# EAGLE schematic brobot_pro_mini (EAGLE 7.2.0)
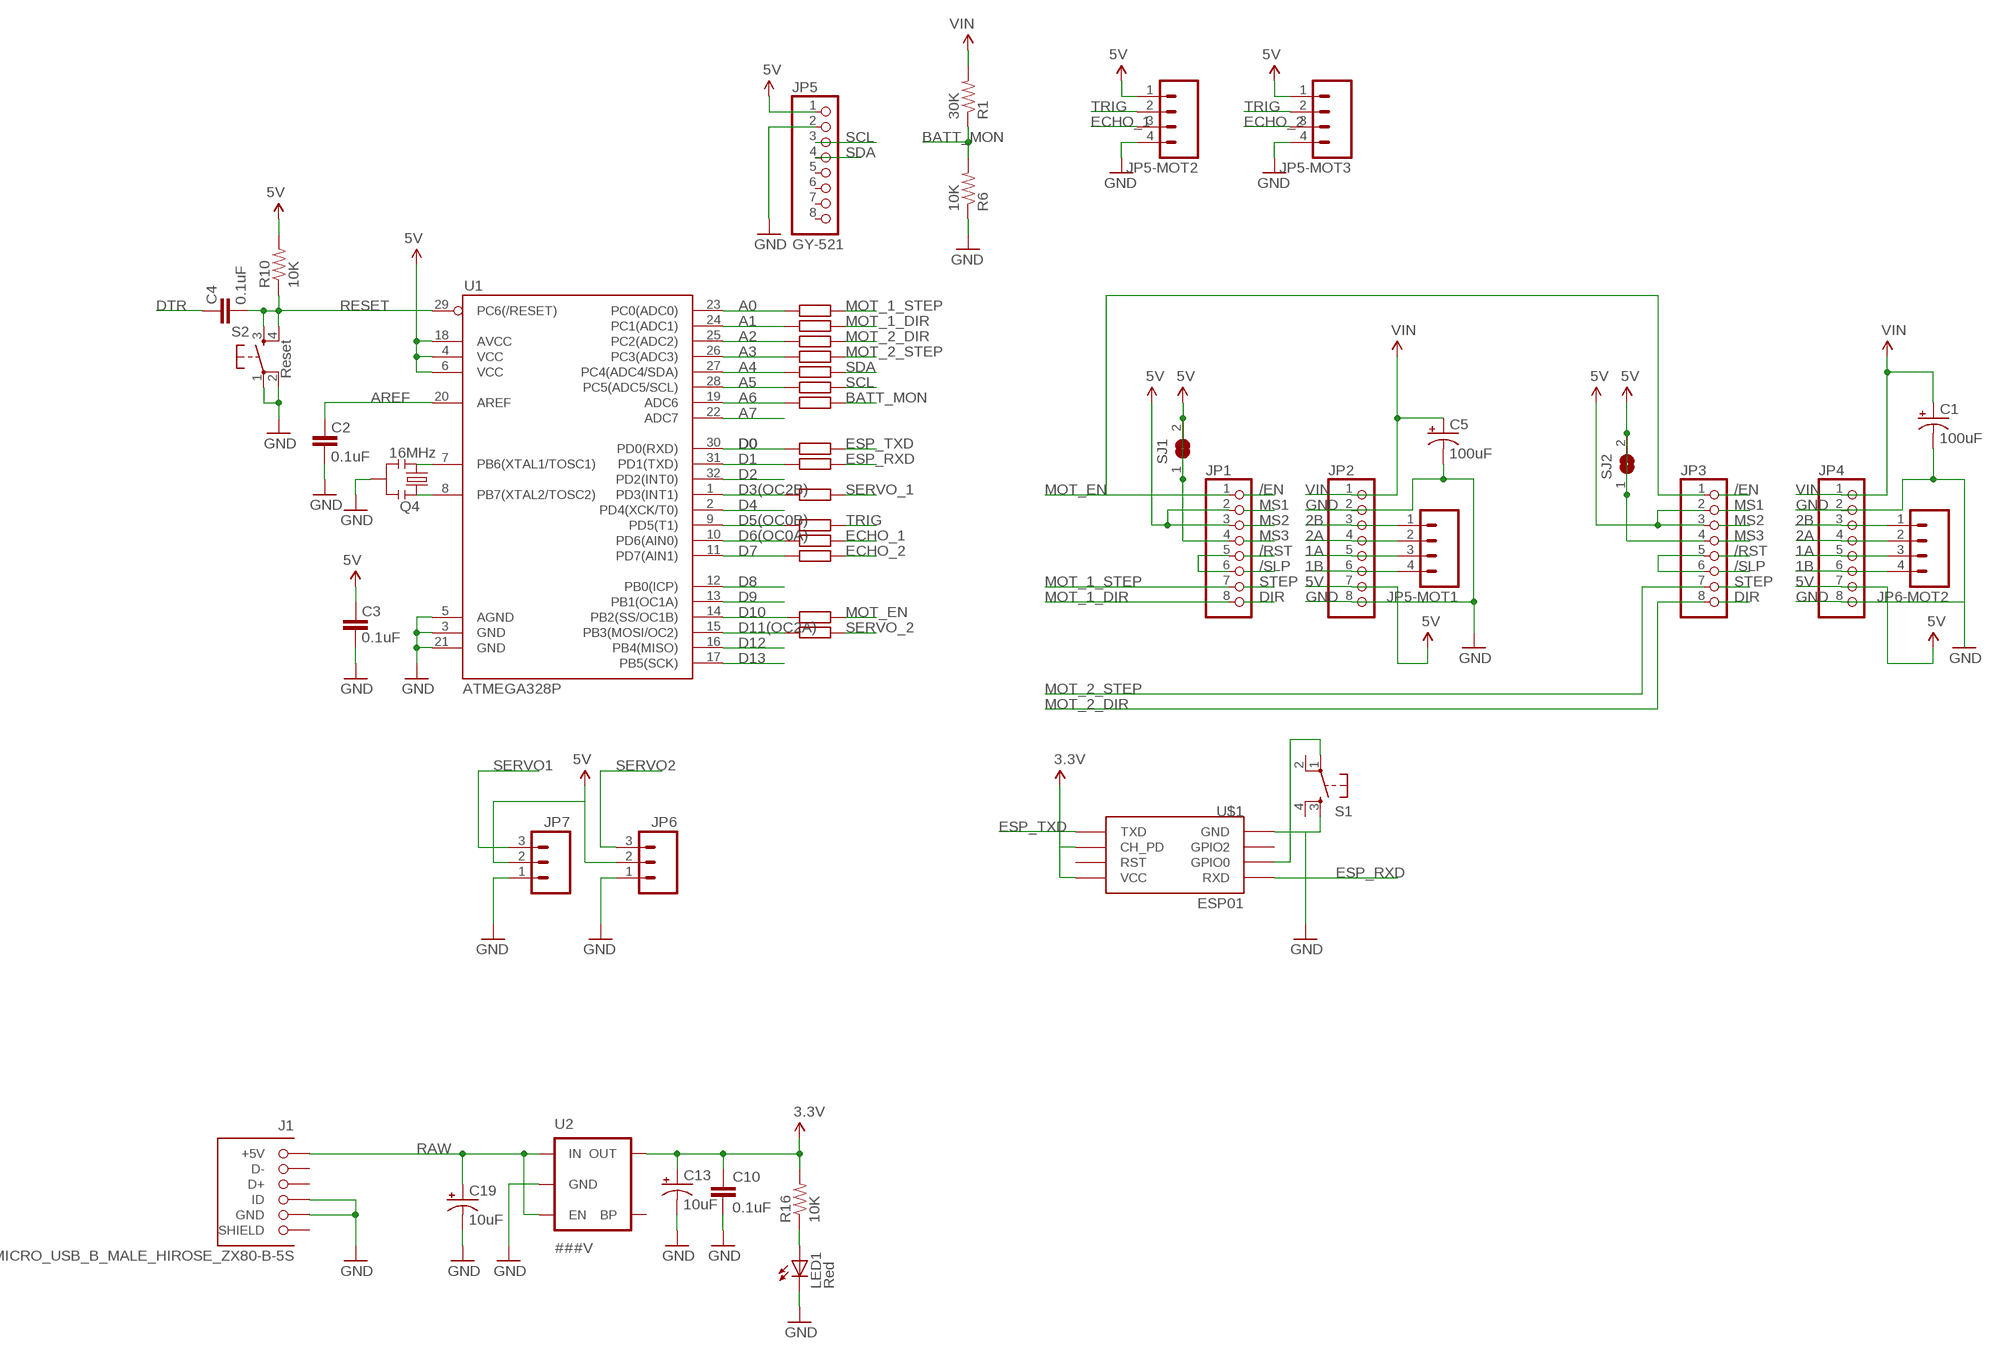
[diagram p0: schematic, sheet 1]

## Parts
C1  100uF  CAP_POLD  [PANASONIC_D]
C2  0.1uF  CAP0402  [C0402]
C3  0.1uF  CAP0402  [C0402]
C4  0.1uF  CAP0402  [C0402]
C5  100uF  CAP_POLD  [PANASONIC_D]
C10  0.1uF  CAP0402  [C0402]
C13  10uF  CAP_POL1206  [EIA3216]
C19  10uF  CAP_POL1206  [EIA3216]
J1  MICRO_USB_B_MALE_HIROSE_ZX80-B-5S  [USB_MICRO_B_MALE-HIROSE-ZX80-B-5S]
JP1  PINHD-1X8  [1X08]
JP2  PINHD-1X8  [1X08]
JP3  PINHD-1X8  [1X08]
JP4  PINHD-1X8  [1X08]
JP5  GY-521  PINHD-1X8  [1X08]
JP5-MOT1  M04PTH  [1X04]
JP5-MOT2  M04PTH  [1X04]
JP5-MOT3  M04PTH  [1X04]
JP6  M03PTH  [1X03]
JP6-MOT2  M04PTH  [1X04]
JP7  M03PTH  [1X03]
LED1  Red  LED0603  [LED-0603]
Q4  16MHz  RESONATORSMD  [RESONATOR-SMD]
R1  30K  RESISTOR0805-RES  [0805]
R6  10K  RESISTOR0805-RES  [0805]
R10  10K  RESISTOR0402  [C0402]
R16  10K  RESISTOR0402  [C0402]
S1  Reset  TAC_SWITCHSND  [TACTILE_SWITCH_SMD]
S2  Reset  TAC_SWITCHSND  [TACTILE_SWITCH_SMD]
SJ1  SJW  [SJW]
SJ2  SJW  [SJW]
U1  ATMEGA328P  ATMEGA168  [TQFP32-08]
U2  ###V  V_REG_LDOSMD  [SOT23-5]
U$1  ESP01  [ESP01]

## Nets
1A: JP2.5 JP4.5 JP5-MOT1.3 JP6-MOT2.3
1B: JP2.6 JP4.6 JP5-MOT1.4 JP6-MOT2.4
2A: JP2.4 JP4.4 JP5-MOT1.2 JP6-MOT2.2
2B: JP2.3 JP4.3 JP5-MOT1.1 JP6-MOT2.1
3.3V: U$1.CH_PD U$1.VCC
5V: C3.2 JP1.2 JP1.3 JP1.4 JP2.7 JP3.2 JP3.3 JP3.4 JP4.7 JP5-MOT2.1 JP5-MOT3.1 JP5.1 JP6.2 JP7.2 R10.2 SJ1.1 SJ1.2 SJ2.1 SJ2.2 U1.4(VCC) U1.6(VCC) U1.18(AVCC)
A0: U1.23(PC0(ADC0))
A1: U1.24(PC1(ADC1))
A2: U1.25(PC2(ADC2))
A3: U1.26(PC3(ADC3))
A4: U1.27(PC4(ADC4/SDA))
A5: U1.28(PC5(ADC5/SCL))
A6: U1.19(ADC6)
A7: U1.22(ADC7)
AREF: C2.2 U1.20(AREF)
BATT_MON: R1.1 R6.2
D0: U1.30(PD0(RXD))
D1: U1.31(PD1(TXD))
D2: U1.32(PD2(INT0))
D3(OC2B): U1.1(PD3(INT1))
D4: U1.2(PD4(XCK/T0))
D5(OC0B): U1.9(PD5(T1))
D6(OC0A): U1.10(PD6(AIN0))
D7: U1.11(PD7(AIN1))
D8: U1.12(PB0(ICP))
D9: U1.13(PB1(OC1A))
D10: U1.14(PB2(SS/OC1B))
D11(OC2A): U1.15(PB3(MOSI/OC2))
D12: U1.16(PB4(MISO))
D13: U1.17(PB5(SCK))
DTR: C4.2
ECHO_1: JP5-MOT2.3
ECHO_2: JP5-MOT3.3
ESP_RXD: U$1.RX(RXD)
ESP_TXD: U$1.TX(TXD)
GND: C1.- C2.1 C3.1 C5.- C10.2 C13.C(-) C19.C(-) J1.4(ID) J1.5(GND) JP2.2 JP2.8 JP4.2 JP4.8 JP5-MOT2.4 JP5-MOT3.4 JP5.2 JP6.1 JP7.1 LED1.C Q4.2 R6.1 S1.3 S2.1 S2.2 U1.3(GND) U1.5(AGND) U1.21(GND) U2.2(GND) U$1.GND
MOT_1_DIR: JP1.8
MOT_1_STEP: JP1.7
MOT_2_DIR: JP3.8
MOT_2_STEP: JP3.7
MOT_EN: JP1.1 JP3.1
N$1: JP1.5 JP1.6
N$2: JP3.5 JP3.6
N$4: S1.1 U$1.GPIO0
N$11: Q4.1 U1.8(PB7(XTAL2/TOSC2))
N$12: Q4.3 U1.7(PB6(XTAL1/TOSC1))
N$38: LED1.A R16.1
RAW [vcc]: C19.A(+) J1.1(+5V) U2.1(IN) U2.3(EN)
RESET: C4.1 R10.1 S2.3 S2.4 U1.29(PC6(/RESET))
SCL: JP5.3
SDA: JP5.4
SERVO1: JP7.3
SERVO2: JP6.3
TRIG: JP5-MOT2.2 JP5-MOT3.2
VCC: C10.1 C13.A(+) R16.2 U2.5(OUT) ; supply symbol labelled 3.3V
VIN: C1.+ C5.+ JP2.1 JP4.1 R1.2
Unconnected: J1.2(D-) J1.3(D+) J1.SHIELD1(SHIELD) J1.SHIELD2(SHIELD) J1.SHIELD3(SHIELD) J1.SHIELD4(SHIELD) JP5.5 JP5.6 JP5.7 JP5.8 S1.2 S1.4 U2.4(BP) U$1.GPIO2 U$1.RST

## Library data of the parts
C1 C5 = SparkFun-Passives:CAP_POL: Capacitor Polarized These are standard SMD and PTH capacitors. Normally 10uF, 47uF, and 100uF in electrolytic and tantalum varieties. Always verify the external diameter of the through hole cap, it varies with capacity, voltage, and manufacturer. The EIA devices should be standard.
C2-C4 C10 = SparkFun:CAP: Capacitor Standard 0603 ceramic capacitor, and 0.1" leaded capacitor.
C13 C19 = SparkFun:CAP_POL: Capacitor Polarized These are standard SMD and PTH capacitors. Normally 10uF, 47uF, and 100uF in electrolytic and tantalum varieties. Always verify the external diameter of the through hole cap, it varies with capacity, voltage, and manufacturer. The EIA devices should be standard.
J1 = connector:MICRO_USB_B_MALE_HIROSE_ZX80-B-5S: CONN PLUG MCR USB B PCB VERT; DIGIKEY: H11612-ND
JP1-JP5 = pinhead:PINHD-1X8: PIN HEADER
JP5-MOT1-JP5-MOT3 JP6-MOT2 = SparkFun-Connectors:M04: Header 4 Standard 4-pin 0.1" header. Use with straight break away headers (SKU : PRT-00116), right angle break away headers (PRT-00553), swiss pins (PRT-00743), machine pins (PRT-00117), and female headers (PRT-00115). Molex polarized connector foot print use with SKU : PRT-08231 with associated crimp pins and housings. 1MM SMD Version SKU: PRT-10208
JP6 JP7 = SparkFun-Connectors:M03: Header 3 Standard 3-pin 0.1" header. Use with straight break away headers (SKU : PRT-00116), right angle break away headers (PRT-00553), swiss pins (PRT-00743), machine pins (PRT-00117), and female headers (PRT-00115). Molex polarized connector foot print use with SKU : PRT-08232 with associated crimp pins and housings.
LED1 = SparkFun:LED: LEDs Standard schematic elements and footprints for 5mm, 3mm, 1206, and 0603 sized LEDs. 5mm - Spark Fun Electronics SKU : COM-00529 (and others)
Q4 = SparkFun:RESONATOR: Resonator Small SMD resonator. This is the itty bitty 10/20MHz resonators with built in caps. CSTCE10M0G55 and CSTCE20M0V53. Footprint has been reviewed closely but hasn't been tested yet.
R1 R6 = SparkFun-Resistors:RESISTOR: Resistor
R10 R16 = SparkFun:RESISTOR: Resistor
S1 S2 = SparkFun:TAC_SWITCH: Momentary Switch Button commonly used for reset or general input. Spark Fun Electronics SKU : COM-00097
SJ1 SJ2 = jumper:SJ: SMD solder JUMPER
U1 = SparkFun:ATMEGA168
U2 = SparkFun:V_REG_LDO: Voltage Regulator LDO Standard 150mA LDO voltage regulator in SOT-23 layout. Micrel part MIC5205. BP (by-pass) pin is used to lower output noise with 470pF cap.
U$1 = esp8266modules:ESP01: ESP8266 Wifi module 01

## Net classes
1 vcc: width 0.254 mm